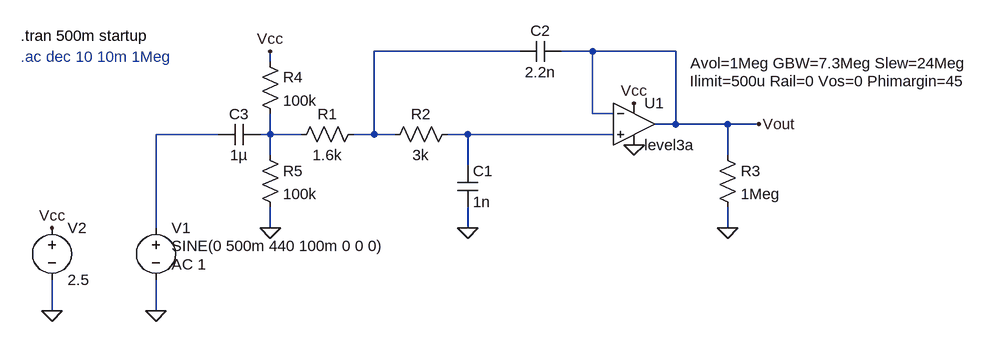
[diagram p0: schematic input_lpf.asc]
input_lpf.asc, the LTspice schematic file:
Version 4
SHEET 1 1240 680
WIRE 496 -48 272 -48
WIRE 608 -48 560 -48
WIRE 736 -48 608 -48
WIRE 112 -32 112 -48
WIRE 608 48 608 -48
WIRE 640 48 608 48
WIRE 736 64 736 -48
WIRE 736 64 704 64
WIRE 816 64 736 64
WIRE 864 64 816 64
WIRE 32 80 -64 80
WIRE 112 80 112 48
WIRE 112 80 96 80
WIRE 160 80 112 80
WIRE 272 80 272 -48
WIRE 272 80 240 80
WIRE 304 80 272 80
WIRE 416 80 384 80
WIRE 640 80 416 80
WIRE 112 112 112 80
WIRE 816 112 816 64
WIRE 416 128 416 80
WIRE -64 224 -64 80
WIRE 112 224 112 192
WIRE 416 224 416 192
WIRE 816 224 816 192
WIRE -224 352 -224 304
WIRE -64 352 -64 304
FLAG 416 224 0
FLAG -64 352 0
FLAG 816 224 0
FLAG -224 352 0
FLAG -224 224 Vcc
FLAG 672 32 Vcc
FLAG 672 96 0
FLAG 112 224 0
FLAG 112 -48 Vcc
FLAG 864 64 Vout
SYMBOL voltage -64 208 R0
WINDOW 3 24 44 Left 2
WINDOW 123 24 72 Left 2
WINDOW 39 0 0 Left 0
SYMATTR Value SINE(0 500m 440 100m 0 0 0)
SYMATTR Value2 AC 1
SYMATTR InstName V1
SYMBOL res 256 64 R90
WINDOW 0 0 56 VBottom 2
WINDOW 3 32 56 VTop 2
SYMATTR InstName R1
SYMATTR Value 1.6k
SYMBOL res 400 64 R90
WINDOW 0 0 56 VBottom 2
WINDOW 3 32 56 VTop 2
SYMATTR InstName R2
SYMATTR Value 3k
SYMBOL cap 400 128 R0
SYMATTR InstName C1
SYMATTR Value 1n
SYMBOL cap 560 -64 R90
WINDOW 0 0 32 VBottom 2
WINDOW 3 32 32 VTop 2
SYMATTR InstName C2
SYMATTR Value 2.2n
SYMBOL res 800 96 R0
SYMATTR InstName R3
SYMATTR Value 1Meg
SYMBOL cap 96 64 R90
WINDOW 0 0 32 VBottom 2
WINDOW 3 32 32 VTop 2
SYMATTR InstName C3
SYMATTR Value 1µ
SYMBOL OpAmps\\UniversalOpAmp3 672 64 R0
WINDOW 123 87 -94 Left 2
WINDOW 39 86 -66 Left 2
WINDOW 40 86 -39 Left 2
SYMATTR Value2 Avol=1Meg GBW=7.3Meg Slew=24Meg
SYMATTR SpiceLine Ilimit=500u Rail=0 Vos=0 Phimargin=45
SYMATTR InstName U1
SYMBOL voltage -224 208 R0
WINDOW 123 0 0 Left 0
WINDOW 39 0 0 Left 0
SYMATTR InstName V2
SYMATTR Value 2.5
SYMBOL res 96 -48 R0
SYMATTR InstName R4
SYMATTR Value 100k
SYMBOL res 96 96 R0
SYMATTR InstName R5
SYMATTR Value 100k
TEXT -272 -40 Left 2 ;.ac dec 10 10m 1Meg
TEXT -272 -72 Left 2 !.tran 500m startup

The netlist it stands for:
* input_lpf.asc
V1 N002 0 SINE(0 500m 440 100m 0 0 0) AC 1
R1 N001 N003 1.6k
R2 N004 N001 3k
C1 N004 0 1n
C2 Vout N001 2.2n
R3 Vout 0 1Meg
C3 N003 N002 1µ
XU1 N004 Vout Vcc 0 Vout level3a Avol=1Meg GBW=7.3Meg Slew=24Meg Ilimit=500u Rail=0 Vos=0 Phimargin=45  ; pins In+ In- V+ V- OUT
V2 Vcc 0 2.5
R4 Vcc N003 100k
R5 N003 0 100k
* .ac dec 10 10m 1Meg
.tran 500m startup
.backanno
.end